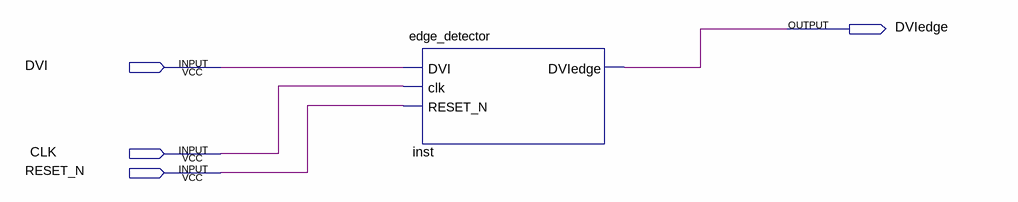
[diagram p0: schematic sheet]
// Quartus schematic edgeDetector.bdf as structural Verilog: 1 symbols, 4 pins
module edgeDetector (
  input  DVI,
  input  CLK,
  input  RESET_N,
  output DVIedge
);

  edge_detector inst (.DVI(DVI), .clk(CLK), .RESET_N(RESET_N), .DVIedge(DVIedge));
endmodule
